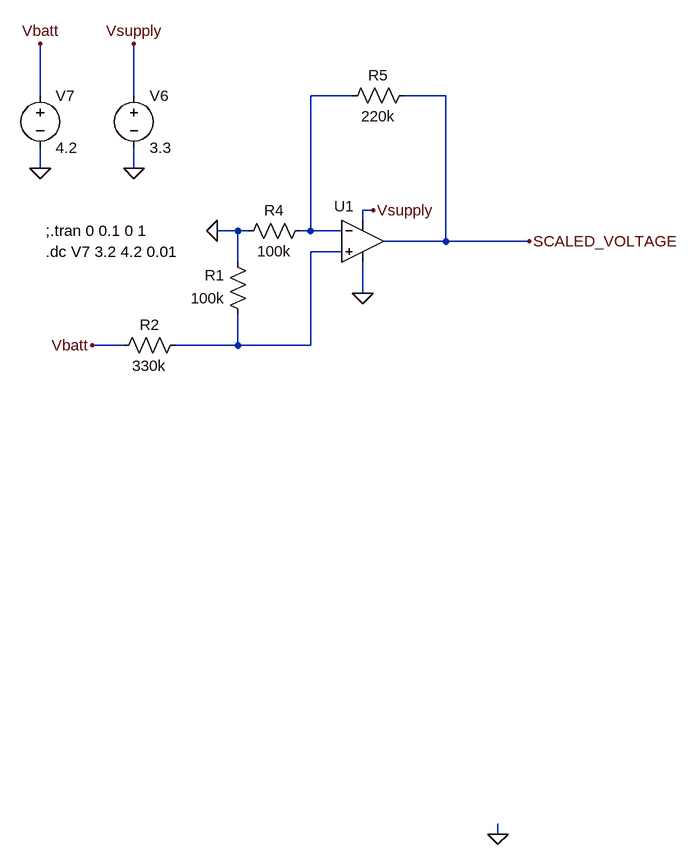
[diagram p0: schematic battery-level-circuit.asc]
battery-level-circuit.asc, the LTspice schematic file:
Version 4
SHEET 1 3072 980
WIRE 688 -320 688 -400
WIRE 832 -320 832 -400
WIRE 1168 -320 1104 -320
WIRE 1312 -320 1248 -320
WIRE 688 -208 688 -240
WIRE 832 -208 832 -240
WIRE 1200 -144 1184 -144
WIRE 1184 -128 1184 -144
WIRE 992 -112 960 -112
WIRE 1008 -112 992 -112
WIRE 1104 -112 1104 -320
WIRE 1104 -112 1088 -112
WIRE 1152 -112 1104 -112
WIRE 1312 -96 1312 -320
WIRE 1312 -96 1216 -96
WIRE 1440 -96 1312 -96
WIRE 1152 -80 1104 -80
WIRE 992 -64 992 -112
WIRE 1184 -16 1184 -64
WIRE 816 64 768 64
WIRE 992 64 992 16
WIRE 992 64 896 64
WIRE 1104 64 1104 -80
WIRE 1104 64 992 64
WIRE 1392 816 1392 800
FLAG 832 -208 0
FLAG 832 -400 Vsupply
FLAG 1200 -144 Vsupply
FLAG 688 -208 0
FLAG 688 -400 Vbatt
FLAG 1392 816 0
FLAG 1440 -96 SCALED_VOLTAGE
FLAG 960 -112 0
FLAG 1184 -16 0
FLAG 768 64 Vbatt
SYMBOL voltage 832 -336 R0
WINDOW 123 0 0 Left 0
WINDOW 39 0 0 Left 0
SYMATTR InstName V6
SYMATTR Value 3.3
SYMBOL res 1104 -128 R90
WINDOW 0 0 56 VBottom 2
WINDOW 3 32 56 VTop 2
SYMATTR InstName R4
SYMATTR Value 100k
SYMBOL res 1264 -336 R90
WINDOW 0 0 56 VBottom 2
WINDOW 3 32 56 VTop 2
SYMATTR InstName R5
SYMATTR Value 220k
SYMBOL OpAmps\\UniversalOpAmp2 1184 -96 R0
WINDOW 0 -44 -54 Left 2
SYMATTR InstName U1
SYMBOL voltage 688 -336 R0
WINDOW 123 0 0 Left 0
WINDOW 39 0 0 Left 0
SYMATTR InstName V7
SYMATTR Value 4.2
SYMBOL res 1008 32 R180
WINDOW 0 36 76 Left 2
WINDOW 3 36 40 Left 2
SYMATTR InstName R1
SYMATTR Value 100k
SYMBOL res 912 48 R90
WINDOW 0 0 56 VBottom 2
WINDOW 3 32 56 VTop 2
SYMATTR InstName R2
SYMATTR Value 330k
TEXT 696 -112 Left 2 !;.tran 0 0.1 0 1
TEXT 696 -80 Left 2 !.dc V7 3.2 4.2 0.01

The netlist it stands for:
* battery-level-circuit.asc
V6 Vsupply 0 3.3
R4 N001 0 100k
R5 SCALED_VOLTAGE N001 220k
XU1 N002 N001 Vsupply 0 SCALED_VOLTAGE level2 Avol=1Meg GBW=10Meg Slew=10Meg Ilimit=25m Rail=0 Vos=0 En=0 Enk=0 In=0 Ink=0 Rin=500Meg  ; pins In+ In- V+ V- OUT
V7 Vbatt 0 4.2
R1 N002 0 100k
R2 N002 Vbatt 330k
;.tran 0 0.1 0 1
.dc V7 3.2 4.2 0.01
.lib UniversalOpAmp2.lib
.backanno
.end

* Results of the author's LTspice run, read from the files saved beside the schematic
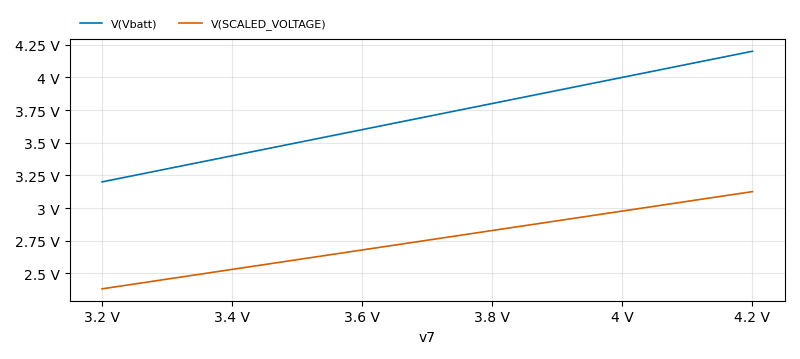
[diagram p1: DC transfer characteristic of battery-level-circuit.asc, plotted from the saved traces]
* DC transfer characteristic, 1 run:
*   V(Vbatt): 3.2 V at v7=3.2 V, 4.2 V at v7=4.2 V, min 3.2 V, max 4.2 V
*   V(SCALED_VOLTAGE): 2.381 V at v7=3.2 V, 3.126 V at v7=4.2 V, min 2.381 V, max 3.126 V